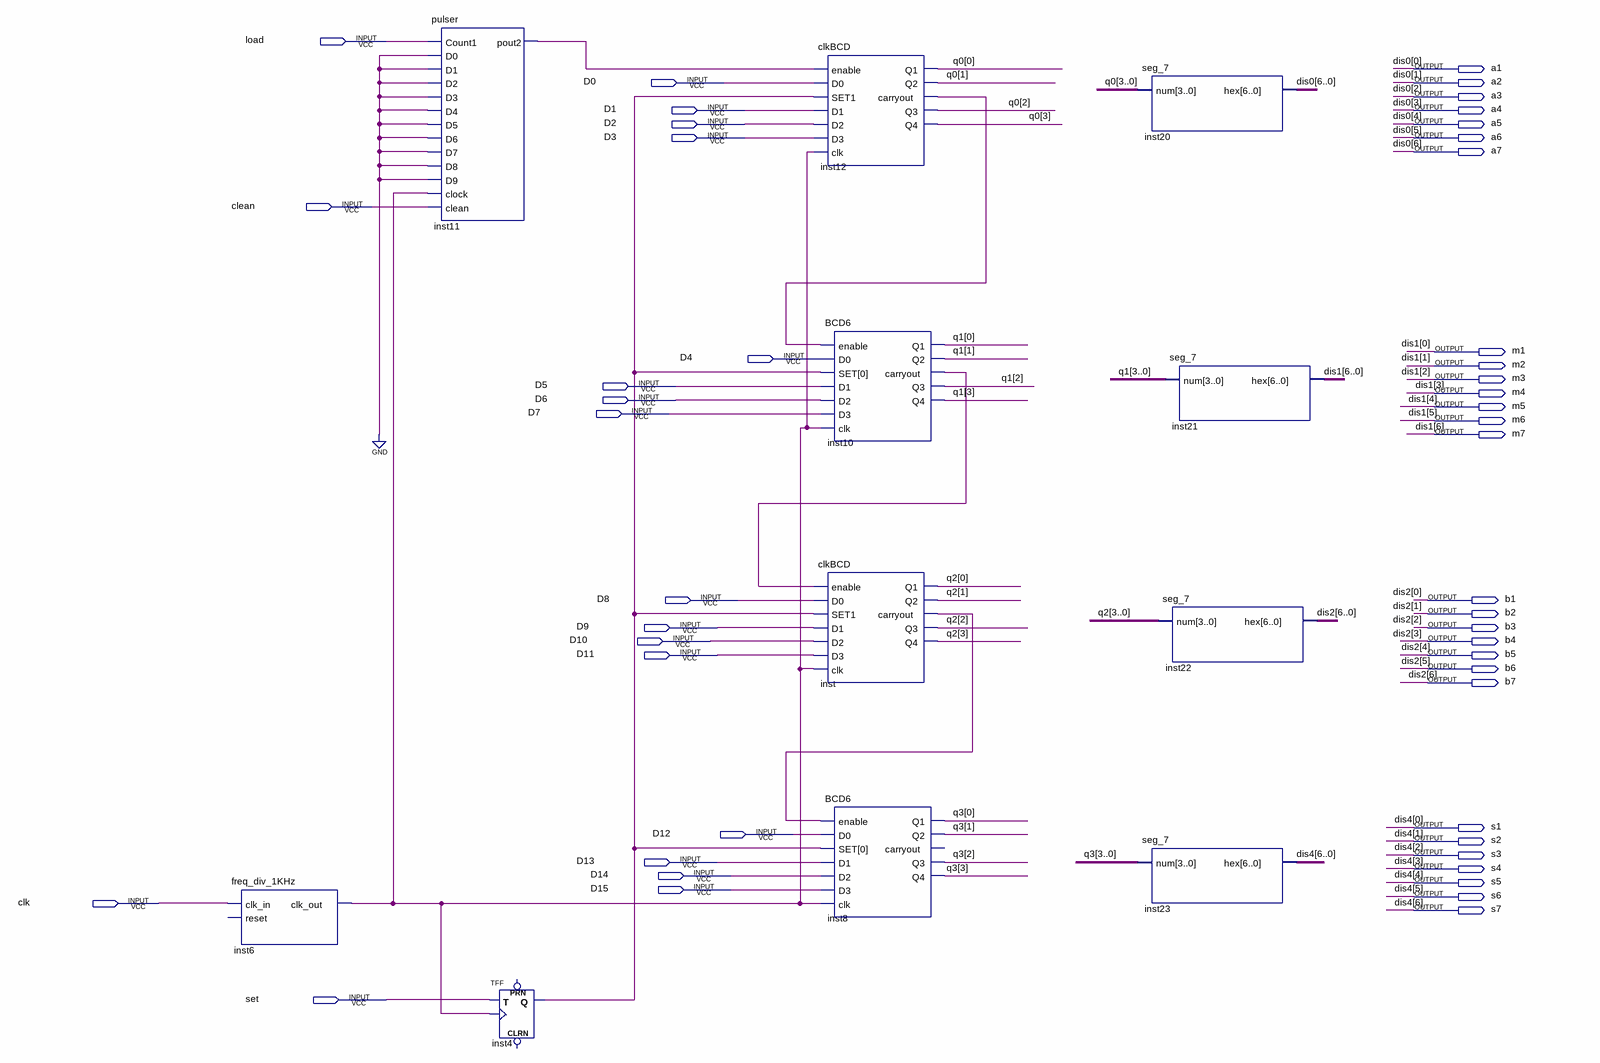
[diagram p0: schematic sheet]
// Quartus schematic FINAL.bdf as structural Verilog: 11 symbols, 48 pins
module FINAL (
  input  load,
  input  D0,
  input  D1,
  input  D2,
  input  D3,
  input  clean,
  input  D4,
  input  D5,
  input  D6,
  input  D7,
  input  D8,
  input  D9,
  input  D10,
  input  D11,
  input  D12,
  input  D13,
  input  D14,
  input  D15,
  input  clk,
  input  set,
  output a1,
  output a2,
  output a3,
  output a4,
  output a5,
  output a6,
  output a7,
  output m1,
  output m2,
  output m3,
  output m4,
  output m5,
  output m6,
  output m7,
  output b1,
  output b2,
  output b3,
  output b4,
  output b5,
  output b6,
  output b7,
  output s1,
  output s2,
  output s3,
  output s4,
  output s5,
  output s6,
  output s7
);

  wire inst4_q, inst6_clk_out, inst10_carryout, inst11_pout2, inst12_carryout, inst_carryout;
  wire [3:0] q0, q1, q2, q3;

  freq_div_1KHz inst6 (.clk_in(clk), .clk_out(inst6_clk_out));  // open: reset
  pulser inst11 (
    .Count1(load), .D0(1'b0), .D1(1'b0), .D2(1'b0), .D3(1'b0), .D4(1'b0), .D5(1'b0), .D6(1'b0), .D7(1'b0),
    .D8(1'b0), .D9(1'b0), .clock(inst6_clk_out), .clean(clean), .pout2(inst11_pout2));
  TFF inst4 (.T(set), .CLK(inst6_clk_out), .Q(inst4_q));  // open: PRN, CLRN
  clkBCD inst12 (
    .enable(inst11_pout2), .D0(D0), .SET1(inst4_q), .D1(D1), .D2(D2), .D3(D3), .clk(inst6_clk_out),
    .Q1(q0[0]), .Q2(q0[1]), .carryout(inst12_carryout), .Q3(q0[2]), .Q4(q0[3]));
  BCD6 inst10 (
    .enable(inst12_carryout), .D0(D4), .SET(inst4_q), .D1(D5), .D2(D6), .D3(D7), .clk(inst6_clk_out),
    .Q1(q1[0]), .Q2(q1[1]), .carryout(inst10_carryout), .Q3(q1[2]), .Q4(q1[3]));
  clkBCD inst (
    .enable(inst10_carryout), .D0(D8), .SET1(inst4_q), .D1(D9), .D2(D10), .D3(D11), .clk(inst6_clk_out),
    .Q1(q2[0]), .Q2(q2[1]), .carryout(inst_carryout), .Q3(q2[2]), .Q4(q2[3]));
  BCD6 inst8 (
    .enable(inst_carryout), .D0(D12), .SET(inst4_q), .D1(D13), .D2(D14), .D3(D15), .clk(inst6_clk_out),
    .Q1(q3[0]), .Q2(q3[1]), .Q3(q3[2]), .Q4(q3[3]));  // open: carryout
  seg_7 inst20 (.num(q0), .hex({a7, a6, a5, a4, a3, a2, a1}));
  seg_7 inst21 (.num(q1), .hex({m7, m6, m5, m4, m3, m2, m1}));
  seg_7 inst22 (.num(q2), .hex({b7, b6, b5, b4, b3, b2, b1}));
  seg_7 inst23 (.num(q3), .hex({s7, s6, s5, s4, s3, s2, s1}));

  // Other names for the same wires on the sheet: dis0[6:0] = {a7, a6, a5, a4, a3, a2, a1};
  //   dis1[6:0] = {m7, m6, m5, m4, m3, m2, m1}; dis2[6:0] = {b7, b6, b5, b4, b3, b2, b1};
  //   dis4[6:0] = {s7, s6, s5, s4, s3, s2, s1}
endmodule
